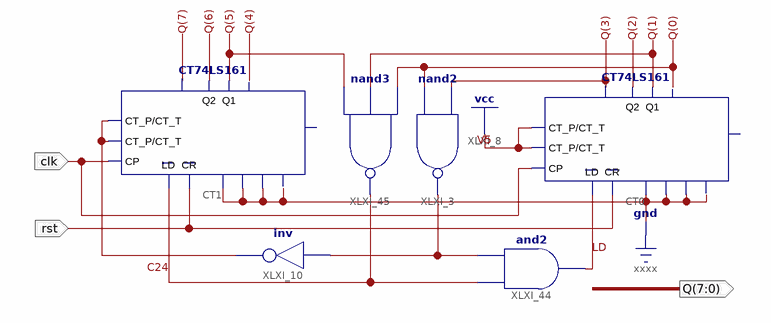
[diagram p0: schematic sheet 1]
// Xilinx ISE schematic Counter_24.sch (kintex7) as structural Verilog: 6 symbols, 3 ports
module Counter_24 (
  input  clk,
  input  rst,
  output [7:0] Q
);

  wire C24, LD, XLXN_11, XLXN_33;

  not XLXI_10 (XLXN_33, XLXN_11);
  nand XLXI_3 (XLXN_11, Q[0], Q[3]);
  CT74LS161 CT0 (
    .D0(1'b0), .D1(1'b0), .D2(1'b0), .D3(1'b0), .CP(clk), .LD(LD), .CR(rst), .CT_P(1'b1), .CT_T(1'b1),
    .Q0(Q[0]), .Q1(Q[1]), .Q2(Q[2]), .Q3(Q[3]));  // open: CO
  CT74LS161 #(.LD(1)) CT1 (
    .D0(1'b0), .D1(1'b0), .D2(1'b0), .D3(1'b0), .CP(clk), .LD(C24), .CR(rst), .CT_P(XLXN_33), .CT_T(XLXN_33),
    .Q0(Q[4]), .Q1(Q[5]), .Q2(Q[6]), .Q3(Q[7]));  // open: CO
  and XLXI_44 (LD, C24, XLXN_11);
  nand XLXI_45 (C24, Q[5], Q[1], Q[0]);
endmodule
